# EAGLE design Placa (EAGLE 6.3)
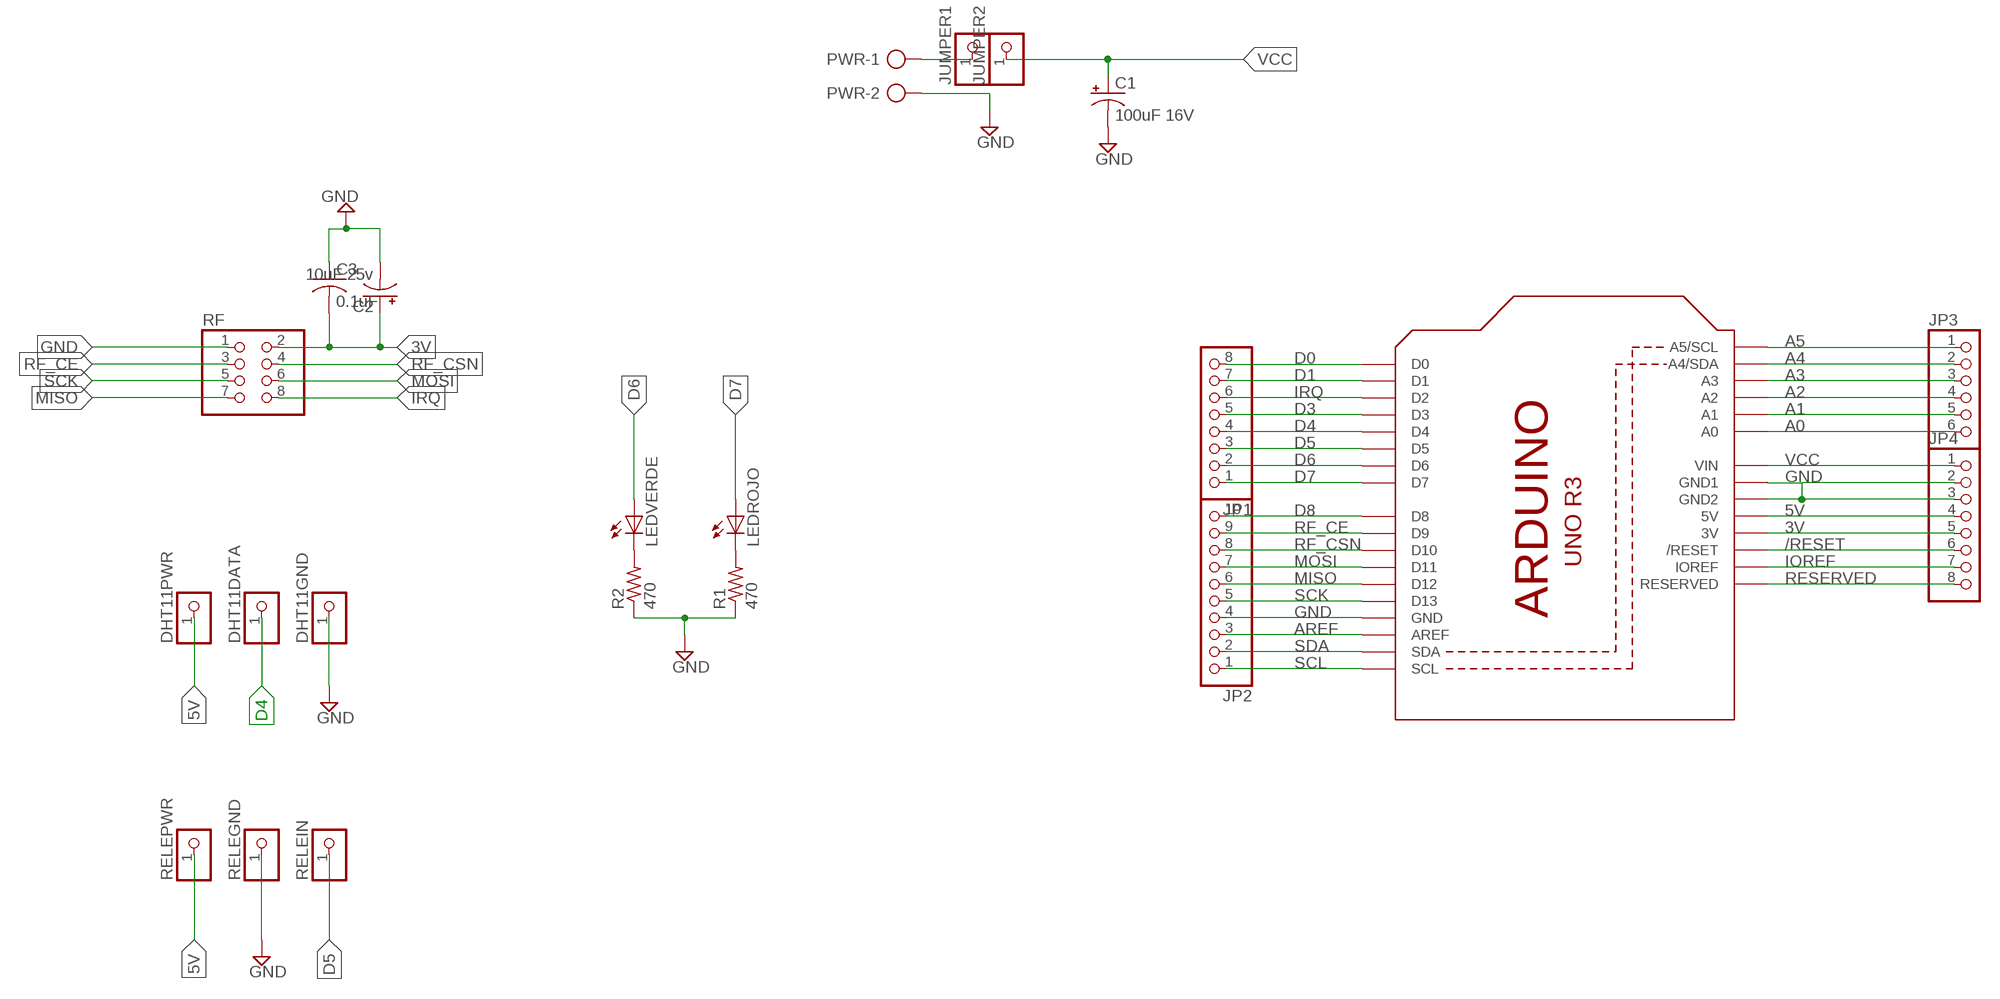
[diagram p0: schematic, sheet 1]

## Parts
C1  100uF 16V  CPOL-USE2.5-7  [E2,5-7]
C2  10uF 25v  CPOL-USE2.5-7  [E2,5-7]
C3  0.1uF  C-US050-024X044  [C050-024X044]
DHT11DATA  PINHD-1X1  [1X01]
DHT11GND  PINHD-1X1  [1X01]
DHT11PWR  PINHD-1X1  [1X01]
JP1  PINHD-1X8  [1X08]
JP2  PINHD-1X10  [1X10]
JP3  PINHD-1X6  [1X06]
JP4  PINHD-1X8  [1X08]
JUMPER1  PINHD-1X1  [1X01]
JUMPER2  PINHD-1X1  [1X01]
LEDROJO  LED5MM  [LED5MM]
LEDVERDE  LED5MM  [LED5MM]
PWR  AK500/2-H  [AK500/2-H]
R1  470  R-US_0204/7  [0204/7]
R2  470  R-US_0204/7  [0204/7]
RELEGND  PINHD-1X1  [1X01]
RELEIN  PINHD-1X1  [1X01]
RELEPWR  PINHD-1X1  [1X01]
RF  PINHD-2X4  [2X04]
U1  ARDUINOR3-DIMENSION  [ARDUINOR3]

## Nets
3V: C2.+ C3.2 JP4.5 RF.2 U1.3V
5V: DHT11PWR.1 JP4.4 RELEPWR.1 U1.5V
/RESET: JP4.6 U1.RESET(/RESET)
A0: JP3.6 U1.A0
A1: JP3.5 U1.A1
A2: JP3.4 U1.A2
A3: JP3.3 U1.A3
A4: JP3.2 U1.A4(A4/SDA)
A5: JP3.1 U1.A5(A5/SCL)
AREF: JP2.3 U1.AREF
D0: JP1.8 U1.D0
D1: JP1.7 U1.D1
D3: JP1.5 U1.D3
D4: DHT11DATA.1 JP1.4 U1.D4
D5: JP1.3 RELEIN.1 U1.D5
D6: JP1.2 LEDVERDE.A U1.D6
D7: JP1.1 LEDROJO.A U1.D7
D8: JP2.10 U1.D8
GND: C1.- C2.- C3.1 DHT11GND.1 JP2.4 JP4.2 JP4.3 PWR.2 R1.1 R2.1 RELEGND.1 RF.1 U1.GND U1.GND1 U1.GND2
IOREF: JP4.7 U1.IOREF
IRQ: JP1.6 RF.8 U1.D2
MISO: JP2.6 RF.7 U1.D12
MOSI: JP2.7 RF.6 U1.D11
N$1: LEDVERDE.K(C) R2.2
N$2: LEDROJO.K(C) R1.2
N$3: JUMPER1.1 PWR.1
RESERVED: JP4.8 U1.RESERVED
RF_CE: JP2.9 RF.3 U1.D9
RF_CSN: JP2.8 RF.4 U1.D10
SCK: JP2.5 RF.5 U1.D13
SCL: JP2.1 U1.SCL
SDA: JP2.2 U1.SDA
VCC: C1.+ JP4.1 JUMPER2.1 U1.VIN

## Library data of the parts
C1 C2 = resistor:CPOL-US: POLARIZED CAPACITOR, American symbol
C3 = resistor:C-US: CAPACITOR, American symbol
DHT11DATA DHT11GND DHT11PWR JUMPER1 JUMPER2 RELEGND RELEIN RELEPWR = pinhead:PINHD-1X1: PIN HEADER
JP1 JP4 = pinhead:PINHD-1X8: PIN HEADER
JP2 = pinhead:PINHD-1X10: PIN HEADER
JP3 = pinhead:PINHD-1X6: PIN HEADER
LEDROJO LEDVERDE = led:LED: LED OSRAM: - CHIPLED LG R971, LG N971, LY N971, LG Q971, LY Q971, LO R971, LY R971 LH N974, LH R974 LS Q976, LO Q976, LY Q976 LO Q996 - Hyper CHIPLED LW Q18S LB Q993, LB Q99A, LB R99A - SideLED LS A670, LO A670, LY A670, LG A670, LP A670 LB A673, LV A673, LT A673, LW A673 LH A674 LY A675 LS A676, LA A676, LO A676, LY A676, LW A676 LS A679, LY A679, LG A679 - Hyper Micro SIDELED® LS Y876, LA Y876, LO Y876, LY Y876 LT Y87S - SmartLED LW L88C, LW L88S LB L89C, LB L89S, LG L890 LS L89K, LO L89K, LY L89K LS L896, LA L896, LO L896, LY L896 - TOPLED LS T670, LO T670, LY T670, LG T670, LP T670 LSG T670, LSP T670, LSY T670, LOP T670, LYG T670 LG T671, LOG T671, LSG T671 LB T673, LV T673, LT T673, LW T673 LH T674 LS T676, LA T676, LO T676, LY T676, LB T676, LH T676, LSB T676, LW T676 LB T67C, LV T67C, LT T67C, LS T67K, LO T67K, LY T67K, LW E67C LS E67B, LA E67B, LO E67B, LY E67B, LB E67C, LV E67C, LT E67C LW T67C LS T679, LY T679, LG T679 LS T770, LO T770, LY T770, LG T770, LP T770 LB T773, LV T773, LT T773, LW T773 LH T774 LS E675, LA E675, LY E675, LS T675 LS T776, LA T776, LO T776, LY T776, LB T776 LHGB T686 LT T68C, LB T68C - Hyper Mini TOPLED® LB M676 - Mini TOPLED Santana® LG M470 LS M47K, LO M47K, LY M47K Source: http://www.osram.convergy.de LUXEON: - LUMILED® LXK2-PW12-R00, LXK2-PW12-S00, LXK2-PW14-U00, LXK2-PW14-V00 LXK2-PM12-R00, LXK2-PM12-S00, LXK2-PM14-U00 LXK2-PE12-Q00, LXK2-PE12-R00, LXK2-PE12-S00, LXK2-PE14-T00, LXK2-PE14-U00 LXK2-PB12-K00, LXK2-PB12-L00, LXK2-PB12-M00, LXK2-PB14-N00, LXK2-PB14-P00, LXK2-PB14-Q00 LXK2-PR12-L00, LXK2-PR12-M00, LXK2-PR14-Q00, LXK2-PR14-R00 LXK2-PD12-Q00, LXK2-PD12-R00, LXK2-PD12-S00 LXK2-PH12-R00, LXK2-PH12-S00 LXK2-PL12-P00, LXK2-PL12-Q00, LXK2-PL12-R00 Source: www.luxeon.com KINGBRIGHT: KA-3528ASYC Source: www.kingbright.com
PWR = con-ptr500:AK500/2-H: CONNECTOR Aug. 2004 / PTR Meßtechnik: Die Bezeichnung der Serie AK505 wurde geändert. Es handelt sich hierbei um AK500 in horizontaler Ausführung.; OC_FARNELL: unknown; OC_NEWARK: unknown
R1 R2 = resistor:R-US_: RESISTOR, American symbol
RF = pinhead:PINHD-2X4: PIN HEADER
U1 = adafruit:ARDUINOR3: This is a new object for the new Arduino R3 - with extra pins that you may want to use (such as IOref, and duplicated A4/A5

## Board
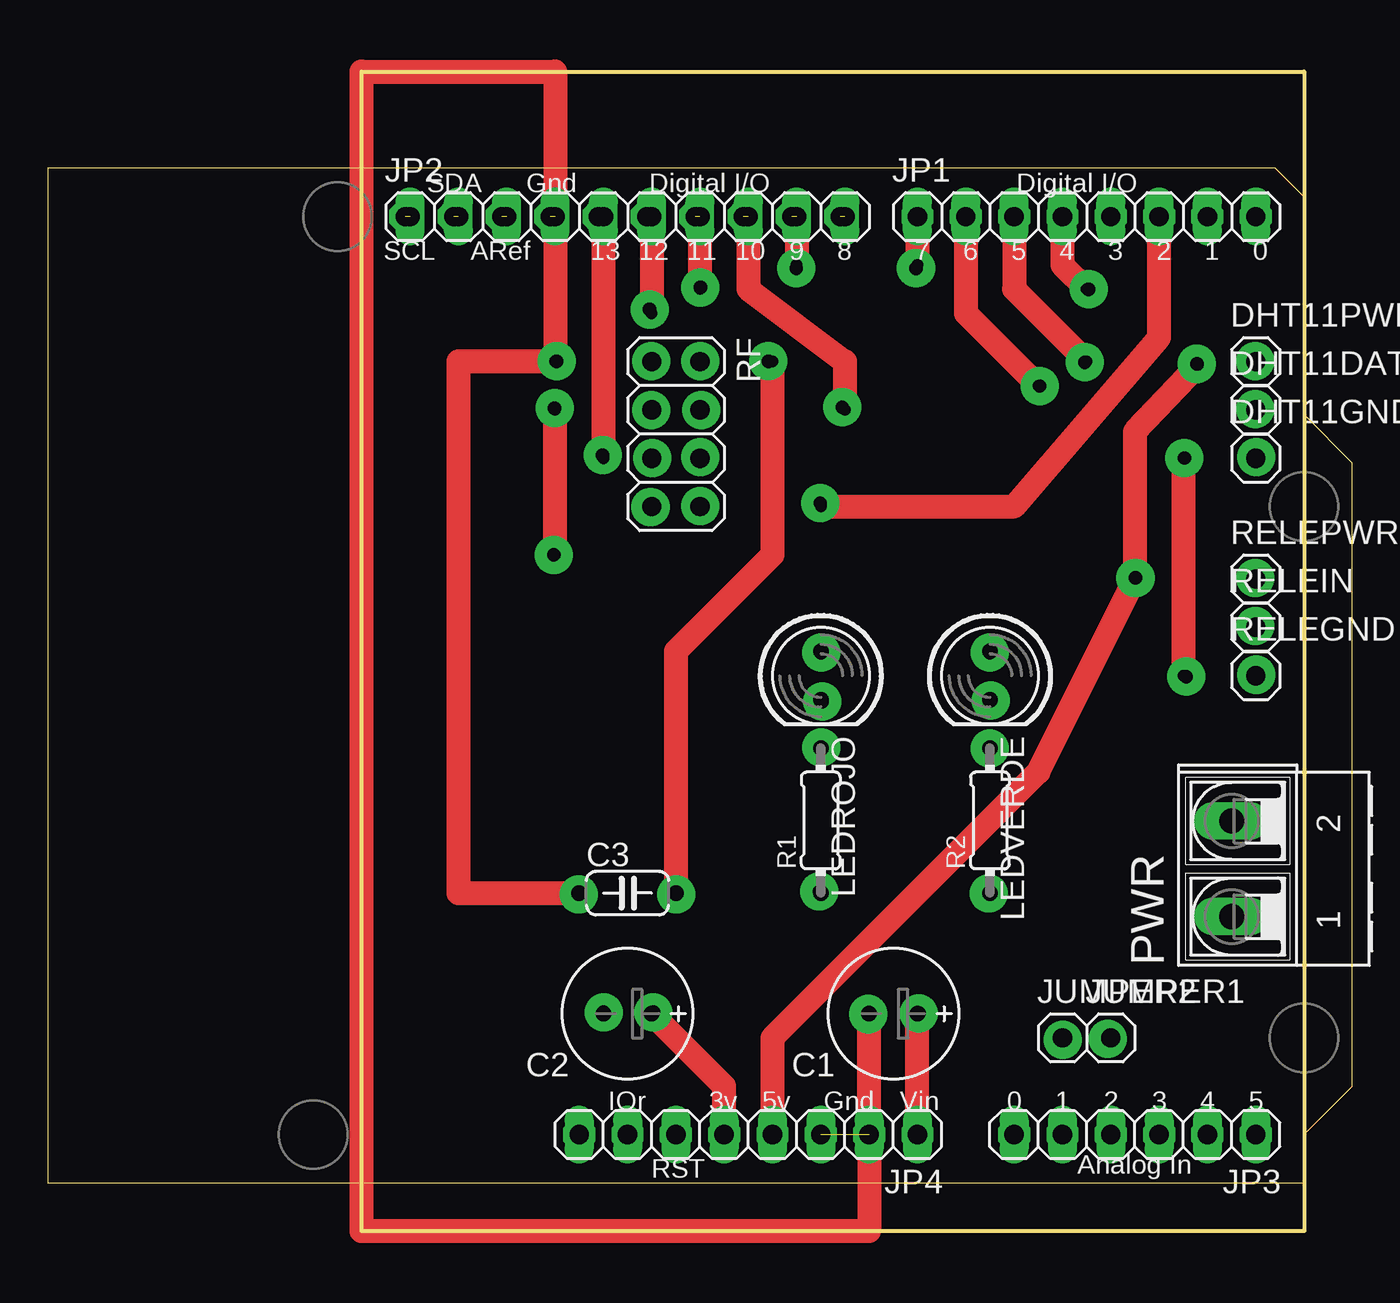
[diagram p1: board, top side]
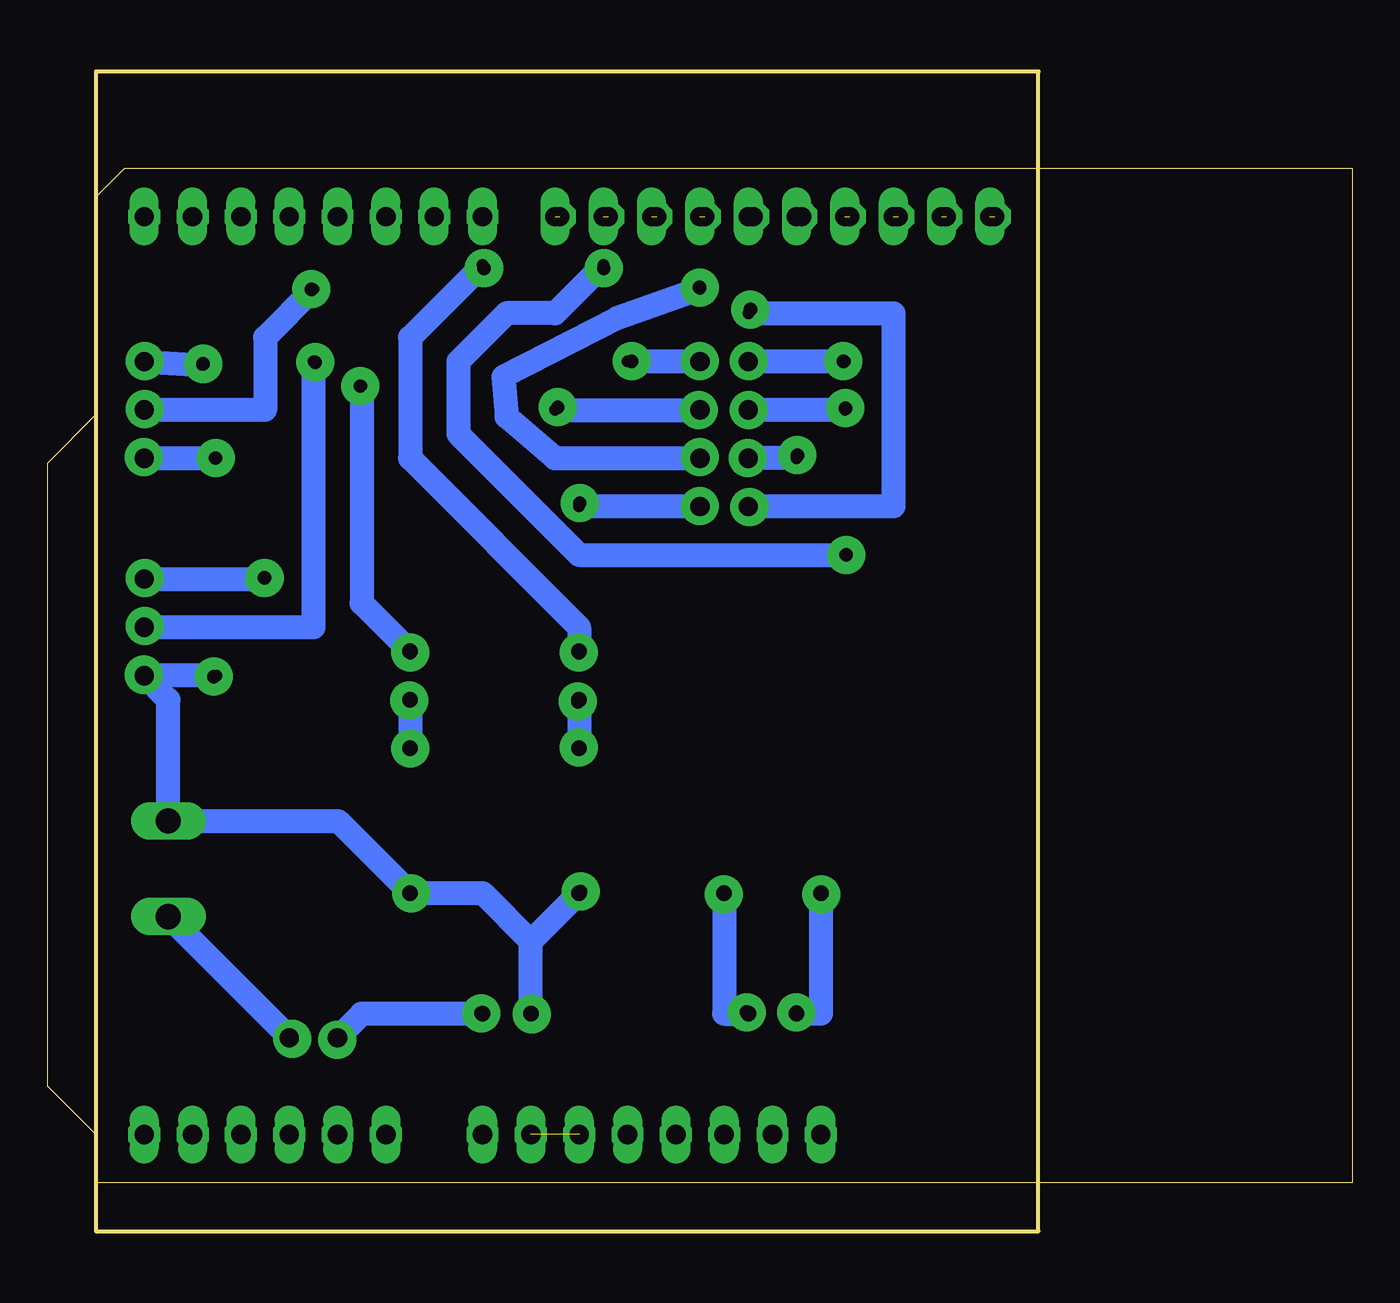
[diagram p2: board, bottom side, seen from below]

Size 49.53 x 60.96 mm. Coordinates in mm from the lower left corner, seen from the top.
Outline: 0,0 0,60.96 49.53,60.96 49.53,0 0,0
Copper layers (1*16): Top 0.035mm / dielectric 1.5mm / Bottom 0.035mm
Design rules "default": minimum track width 10mil, minimum drill 24mil, track to track 8mil, track to pad 8mil, pad to pad 8mil, via to via 8mil, smd to smd 8mil, copper to edge 40mil, drill to drill 8mil, minimum pad ring 10mil, minimum via ring 8mil, stop-mask expansion 4mil, vias tented up to drill 0mil, thermal gap 10mil

### Footprints (pad centres in the part's own frame; a part is rotated, then mirrored left to right if it is on the bottom)
E2,5-7 = drill 0.813 pad 1.6: + -1.27,0 | drill 0.813 pad 1.6 octagon: - 1.27,0
C050-024X044 = drill 0.813 octagon: 1 -2.54,0; 2 2.54,0
1X01 = drill 1.016 octagon: 1 0,0
1X08 = drill 1.016 long: 1 -8.89,0; 2 -6.35,0; 3 -3.81,0; 4 -1.27,0; 5 1.27,0; 6 3.81,0; 7 6.35,0; 8 8.89,0
1X10 = drill 1.016 long: 1 -11.43,0; 2 -8.89,0; 3 -6.35,0; 4 -3.81,0; 5 -1.27,0; 6 1.27,0; 7 3.81,0; 8 6.35,0; 9 8.89,0; 10 11.43,0
1X06 = drill 1.016 long: 1 -6.35,0; 2 -3.81,0; 3 -1.27,0; 4 1.27,0; 5 3.81,0; 6 6.35,0
LED5MM = drill 0.813 octagon: A -1.27,0; K 1.27,0
AK500/2-H = drill 1.321 long: 1 -2.515,0; 2 2.515,0
0204/7 = drill 0.813 octagon: 1 -3.81,0; 2 3.81,0
2X04 = drill 1.016 octagon: 1 -3.81,-1.27; 2 -3.81,1.27; 3 -1.27,-1.27; 4 -1.27,1.27; 5 1.27,-1.27; 6 1.27,1.27; 7 3.81,-1.27; 8 3.81,1.27
ARDUINOR3 = drill 1 pad 1.676 octagon: 3V 35.56,2.54; 5V 38.1,2.54; A0 50.8,2.54; A1 53.34,2.54; A2 55.88,2.54; A3 58.42,2.54; A4 60.96,2.54; A5 63.5,2.54; AREF 23.876,50.8; D0 63.5,50.8; D1 60.96,50.8; D2 58.42,50.8; D3 55.88,50.8; D4 53.34,50.8; D5 50.8,50.8; D6 48.26,50.8; D7 45.72,50.8; D8 41.656,50.8; D9 39.116,50.8; D10 36.576,50.8; D11 34.036,50.8; D12 31.496,50.8; D13 28.956,50.8; GND 26.416,50.8; GND1 43.18,2.54; GND2 40.64,2.54; IOREF 30.48,2.54; RESERVED 27.94,2.54; RESET 33.02,2.54; SCL 18.796,50.8; SDA 21.336,50.8; VIN 45.72,2.54

### Placement (x,y rotation side)
C1  27.94,11.43 180 top
C2  13.97,11.43 180 top
C3  13.97,17.78 0 top
DHT11DATA  46.99,43.18 0 top
DHT11GND  46.99,40.64 0 top
DHT11PWR  46.99,45.72 0 top
JP1  38.1,53.34 0 top
JP2  13.97,53.34 0 top
JP3  40.64,5.08 180 top
JP4  20.32,5.08 180 top
JUMPER1  39.37,10.16 0 top
JUMPER2  36.83,10.16 0 top
LEDROJO  24.13,29.21 270 top
LEDVERDE  33.02,29.21 270 top
PWR  45.72,19.05 90 top
R1  24.13,21.59 90 top
R2  33.02,21.59 90 top
RELEGND  46.99,29.21 0 top
RELEIN  46.99,31.75 0 top
RELEPWR  46.99,34.29 0 top
RF  16.51,41.91 270 top
U1  -16.51,2.54 0 top

### Tracks (layer width: path | path; a pad name or v marks a point on that pad's centre or on a via)
3V  (via drill 0.6)
  Top 1.27: v21.59,45.72 21.59,35.56 16.51,30.48 C3.2 | JP4.5 19.05,7.62 C2.+
  Bottom 1.27: C3.2 16.51,11.43 C2.+ | RF.2 v21.59,45.72
5V  (via drill 0.6)
  Top 1.27: v43.96,45.55 40.64,42.03 v40.64,34.29 35.56,24.13 21.59,10.16 U1.5V
  Bottom 1.27: DHT11PWR.1 v43.96,45.55 | RELEPWR.1 v40.64,34.29
AREF  (1 unrouted)
D4  (via drill 0.6)
  Top 1.27: JP1.4 36.83,50.8 v38.1,49.53
  Bottom 1.27: v38.1,49.53 40.64,46.99 40.64,43.18 DHT11DATA.1
D5  (via drill 0.6)
  Top 1.27: JP1.3 34.29,49.53 v38.1,45.72
  Bottom 1.27: v38.1,45.72 38.1,31.75 RELEIN.1
D6  (via drill 0.6)
  Top 1.27: JP1.2 31.75,48.26 v35.56,44.45
  Bottom 1.27: v35.56,44.45 35.56,33.02 LEDVERDE.A
D7  (via drill 0.6)
  Top 1.27: JP1.1 v29.21,50.8
  Bottom 1.27: v29.21,50.8 33.02,46.99 33.02,40.64 24.13,31.75 LEDROJO.A
D8  (1 unrouted)
GND  (via drill 0.6)  (2 unrouted)
  Top 1.27: C3.1 5.08,17.78 5.08,45.72 v10.16,45.72 JP2.4 10.16,60.96 0,60.96 0,0 26.67,0 U1.GND1 C1.- | v43.18,40.64 v43.18,29.21
  Bottom 1.27: v10.16,45.72 RF.1 | C3.1 11.43,11.43 C2.- | C1.- 26.67,15.24 | 26.67,15.24 R1.1 | 26.67,15.24 29.21,17.78 R2.1 36.8,21.56 PWR.2 45.72,27.94 RELEGND.1 v43.18,29.21 | DHT11GND.1 v43.18,40.64
IRQ  (via drill 0.6)
  Top 1.27: v24.13,38.1 34.29,38.1 41.91,46.99 JP1.6
  Bottom 1.27: RF.8 v24.13,38.1
MISO  (via drill 0.6)
  Top 1.27: U1.D12 JP2.6 v15.24,48.26
  Bottom 1.27: v15.24,48.26 7.62,48.26 7.62,38.1 RF.7
MOSI  (via drill 0.6)  (1 unrouted)
  Top 1.27: JP2.7 v17.78,49.53
  Bottom 1.27: RF.6 25.4,40.64 27.95,42.82 28.11,44.93 22.11,48.01 v17.78,49.53
N$1
  Bottom 1.27: LEDVERDE.K R2.2
N$2
  Bottom 1.27: LEDROJO.K R1.2
N$3
  Bottom 1.27: JUMPER1.1 39.37,10.18 PWR.1
N$4  (via drill 0.7 pad 2)
  other vias: 17.8,45.74
N$5  (via drill 0.7 pad 2)
  other vias: 17.85,43.17
N$6  (via drill 0.7 pad 2)
  other vias: 17.8,40.7
N$7  (via drill 0.7 pad 2)
  other vias: 17.8,38.13
N$8  (via drill 0.7 pad 2)
  other vias: 15.18,38.07
N$9  (via drill 0.7 pad 2)
  other vias: 15.28,40.65
N$10  (via drill 0.7 pad 2)
  other vias: 15.23,43.17
N$11  (via drill 0.7 pad 2)
  other vias: 15.23,45.74
N$12  (via drill 0.7 pad 2)
  other vias: 24.15,30.41
N$13  (via drill 0.7 pad 2)
  other vias: 24.2,27.84
N$14  (via drill 0.7 pad 2)
  other vias: 24.15,25.42
N$15  (via drill 0.7 pad 2)
  other vias: 33.01,25.37
N$16  (via drill 0.7 pad 2)
  other vias: 33.06,27.89
N$17  (via drill 0.7 pad 2)
  other vias: 33.01,30.41
N$18  (via drill 0.7 pad 2)
  other vias: 16.54,17.71
N$19  (via drill 0.7 pad 2)
  other vias: 11.4,17.71
N$20  (via drill 0.7 pad 2)
  other vias: 24.04,17.86
N$21  (via drill 0.7 pad 2)
  other vias: 32.96,17.76
N$22  (via drill 0.7 pad 2)
  other vias: 36.84,10.05
N$23  (via drill 0.7 pad 2)
  other vias: 39.21,10.1
N$24  (via drill 0.7 pad 2)
  other vias: 29.28,11.46
N$25  (via drill 0.7 pad 2)
  other vias: 26.61,11.41
N$26  (via drill 0.7 pad 2)
  other vias: 47.02,29.25
N$27  (via drill 0.7 pad 2)
  other vias: 46.97,31.82
N$28  (via drill 0.7 pad 2)
  other vias: 46.97,34.34
N$29  (via drill 0.7 pad 2)
  other vias: 47.02,40.7
N$30  (via drill 0.7 pad 2)
  other vias: 46.97,43.22
N$31  (via drill 0.7 pad 2)
  other vias: 46.97,45.74
N$32  (via drill 0.7 pad 2)
  other vias: 43.9,45.6
N$33  (via drill 0.7 pad 2)
  other vias: 43.24,40.65
N$34  (via drill 0.7 pad 2)
  other vias: 43.34,29.15
N$35  (via drill 0.7 pad 2)
  other vias: 24.1,38.28
N$36  (via drill 0.7 pad 2)
  other vias: 35.63,44.43
N$37  (via drill 0.7 pad 2)
  other vias: 38,45.69
N$38  (via drill 0.7 pad 2)
  other vias: 38.2,49.52
N$39  (via drill 0.7 pad 2)
  other vias: 29.13,50.63
N$40  (via drill 0.7 pad 2)
  other vias: 22.84,50.63
N$41  (via drill 0.7 pad 2)
  other vias: 25.25,43.32
N$42  (via drill 0.7 pad 2)
  other vias: 17.8,49.62
N$43  (via drill 0.7 pad 2)
  other vias: 15.13,48.46
N$44  (via drill 0.7 pad 2)
  other vias: 10.24,45.74
N$45  (via drill 0.7 pad 2)
  other vias: 10.14,43.27
N$46  (via drill 0.7 pad 2)
  other vias: 10.09,35.55
N$47  (via drill 0.7 pad 2)
  other vias: 12.66,40.8
N$48  (via drill 0.7 pad 2)
  other vias: 40.67,34.34
N$49  (via drill 0.7 pad 2)
  other vias: 21.37,45.74
N$50  (via drill 0.7 pad 2)
  other vias: 12.71,11.51
N$51  (via drill 0.7 pad 2)
  other vias: 15.33,11.51
RF_CE  (via drill 0.6)  (1 unrouted)
  Top 1.27: JP2.9 v22.86,50.8 | v10.16,35.56 v10.16,43.18
  Bottom 1.27: v10.16,35.56 24.13,35.56 30.48,41.91 30.48,45.72 27.94,48.26 25.4,48.26 v22.86,50.8 | v10.16,43.18 RF.3
RF_CSN  (via drill 0.6)  (1 unrouted)
  Top 1.27: JP2.8 20.32,49.53 25.4,45.72 v25.4,43.18
  Bottom 1.27: v25.4,43.18 RF.4
SCK  (via drill 0.6)
  Top 1.27: U1.D13 JP2.5 v12.7,40.64
  Bottom 1.27: v12.7,40.64 RF.5
SCL  (1 unrouted)
SDA  (1 unrouted)
VCC
  Top 1.27: U1.VIN C1.+
  Bottom 1.27: C1.+ 35.56,11.43 JUMPER2.1